# Altium schematic sheet MB1035.SchDoc
size A4; DocumentNumber: 1; Revision: C.1(PCB.SCH); SheetNumber: 1; SheetTotal: 4; PageSetup: Record=PageOptions|CenterHorizontal=True|CenterVertical=True|PrintScale=1.00|XCorrection=1.00|YCorrection=1.00|PrintKind=1|BorderSize=5000000|LeftOffset=0|BottomOffset=0|Orientation=2|PaperLength=1000|PaperWidth=1000|Scale=100|PaperSource=15|PrintQuality=1200|MediaType=1|DitherType=10|PaperKind=A4|PrintScaleMode=1
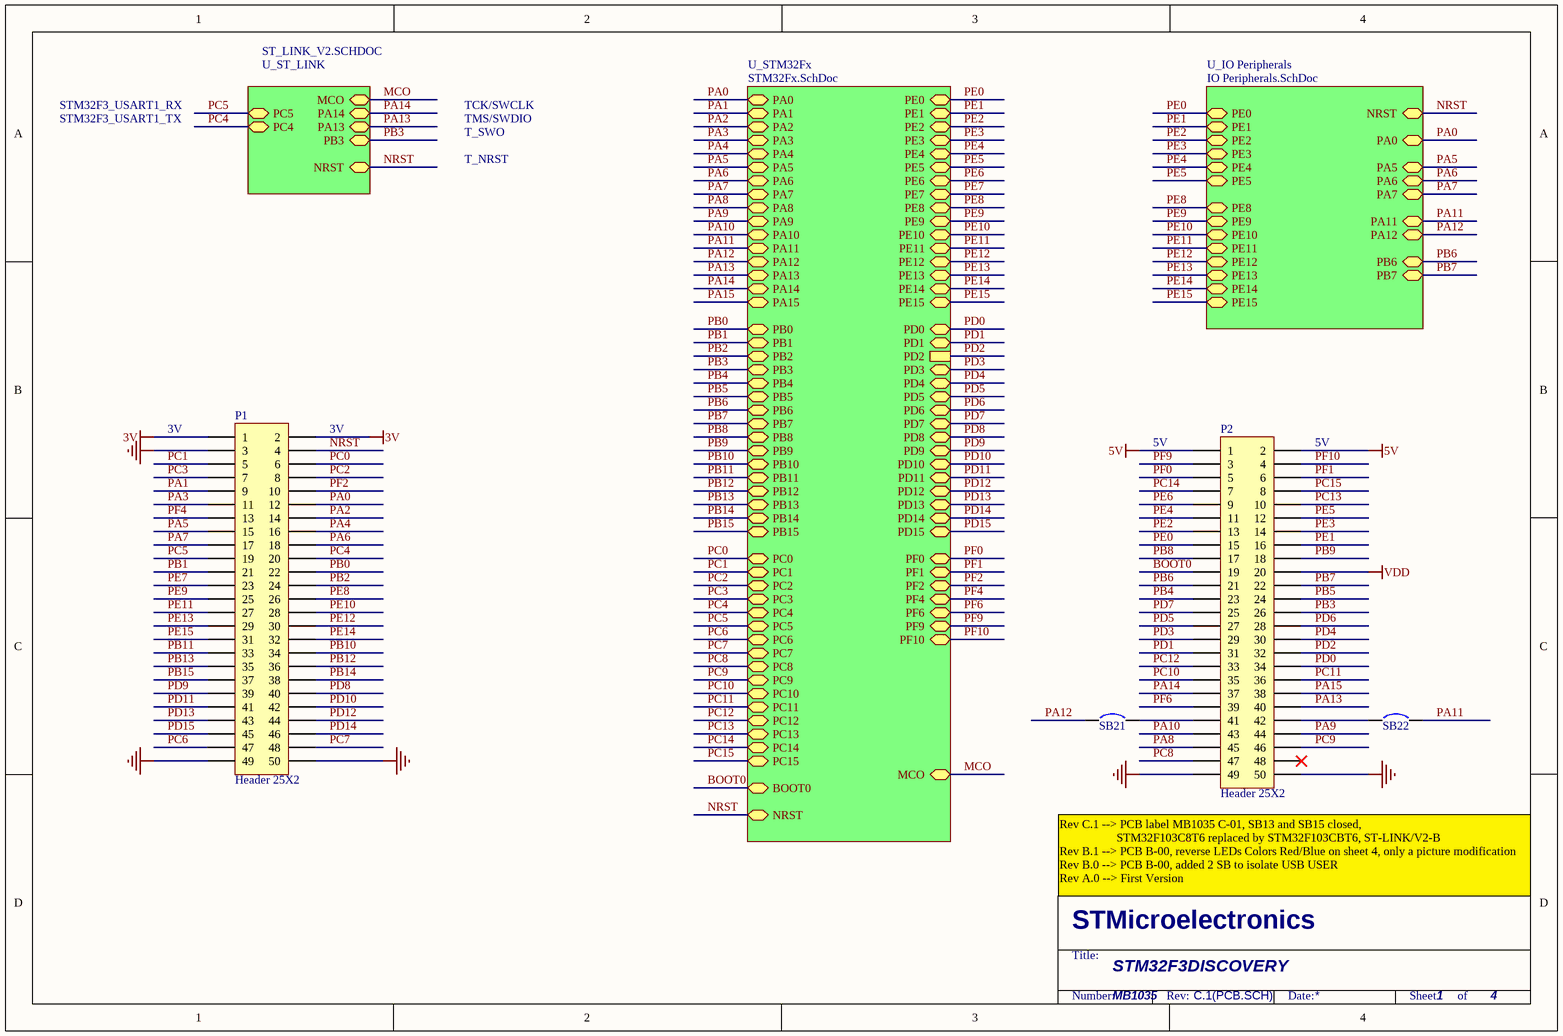
[diagram p0: MB1035.SchDoc]

## Parts
P1  Header 25X2  [HEAD25X2/2.54]
P2  Header 25X2  [HEAD25X2/2.54]
SB21  Circuit Breaker  [JP2_SMD]  (value not drawn)
SB22  Circuit Breaker  [JP2_SMD]  (value not drawn)

## Sub-sheets
U_IO Peripherals = IO Peripherals.SchDoc: PA0, NRST, PE0, PE1, PE3, PA5, PA7, PA6, PB6, PB7, PE4, PE5, PE2, PE8, PE15, PA11, PA12, PE9, PE10, PE11, PE12, PE13, PE14
U_ST_LINK = ST_LINK_V2.SCHDOC: PA13, PA14, NRST, PC5, PC4, PB3, MCO
U_STM32Fx = STM32Fx.SchDoc: PB8, PC5, PC4, PD2, BOOT0, NRST, PE0, PE1, PE2, PE3, PE4, PE5, PE6, PE7, PE8, PE9, PE10, PE11, PE12, PE13, PE14, PE15, PD0, PD1, PD3, PD4, PD5, PD6, PD7, PD8, PD9, PD10, PD11, PD12, PD13, PD14, PD15, PC15, PC14, PF1, PF0, MCO, PF2, PF4, PF6, PF9, PF10, PC0, PC1, PC2, PC3, PC6, PC7, PC8, PC9, PC10, PC11, PC12, PC13, PA0, PA1, PA2, PA3, PA4, PA5, PA6, PA7, PA8, PA9, PA10, PA11, PA12, PA13, PA14, PA15, PB0, PB1, PB2, PB3, PB4, PB5, PB6, PB7, PB9, PB10, PB11, PB12, PB13, PB14, PB15

## Nets
3V: P1.1 P1.2
5V: P2.1 P2.2
GND: P1.3 P1.49 P1.50 P2.49 P2.50
VDD: P2.20
BOOT0: P2.19 ; sheet U_STM32Fx/BOOT0
MCO: sheet U_ST_LINK/MCO, sheet U_STM32Fx/MCO
NRST: P1.4 ; sheet U_ST_LINK/NRST, sheet U_IO Peripherals/NRST, sheet U_STM32Fx/NRST
PA0: P1.12 ; sheet U_IO Peripherals/PA0, sheet U_STM32Fx/PA0
PA1: P1.9 ; sheet U_STM32Fx/PA1
PA2: P1.14 ; sheet U_STM32Fx/PA2
PA3: P1.11 ; sheet U_STM32Fx/PA3
PA4: P1.16 ; sheet U_STM32Fx/PA4
PA5: P1.15 ; sheet U_IO Peripherals/PA5, sheet U_STM32Fx/PA5
PA6: P1.18 ; sheet U_IO Peripherals/PA6, sheet U_STM32Fx/PA6
PA7: P1.17 ; sheet U_IO Peripherals/PA7, sheet U_STM32Fx/PA7
PA8: P2.45 ; sheet U_STM32Fx/PA8
PA9: P2.44 ; sheet U_STM32Fx/PA9
PA10: P2.43 ; sheet U_STM32Fx/PA10
PA11: SB22.2 ; sheet U_IO Peripherals/PA11, sheet U_STM32Fx/PA11
PA12: SB21.1 ; sheet U_IO Peripherals/PA12, sheet U_STM32Fx/PA12
PA13: P2.40 ; sheet U_ST_LINK/PA13, sheet U_STM32Fx/PA13
PA14: P2.37 ; sheet U_ST_LINK/PA14, sheet U_STM32Fx/PA14
PA15: P2.38 ; sheet U_STM32Fx/PA15
PB0: P1.22 ; sheet U_STM32Fx/PB0
PB1: P1.21 ; sheet U_STM32Fx/PB1
PB2: P1.24 ; sheet U_STM32Fx/PB2
PB3: P2.26 ; sheet U_ST_LINK/PB3, sheet U_STM32Fx/PB3
PB4: P2.23 ; sheet U_STM32Fx/PB4
PB5: P2.24 ; sheet U_STM32Fx/PB5
PB6: P2.21 ; sheet U_IO Peripherals/PB6, sheet U_STM32Fx/PB6
PB7: P2.22 ; sheet U_IO Peripherals/PB7, sheet U_STM32Fx/PB7
PB8: P2.17 ; sheet U_STM32Fx/PB8
PB9: P2.18 ; sheet U_STM32Fx/PB9
PB10: P1.34 ; sheet U_STM32Fx/PB10
PB11: P1.33 ; sheet U_STM32Fx/PB11
PB12: P1.36 ; sheet U_STM32Fx/PB12
PB13: P1.35 ; sheet U_STM32Fx/PB13
PB14: P1.38 ; sheet U_STM32Fx/PB14
PB15: P1.37 ; sheet U_STM32Fx/PB15
PC0: P1.6 ; sheet U_STM32Fx/PC0
PC1: P1.5 ; sheet U_STM32Fx/PC1
PC2: P1.8 ; sheet U_STM32Fx/PC2
PC3: P1.7 ; sheet U_STM32Fx/PC3
PC4: P1.20 ; sheet U_ST_LINK/PC4, sheet U_STM32Fx/PC4
PC5: P1.19 ; sheet U_ST_LINK/PC5, sheet U_STM32Fx/PC5
PC6: P1.47 ; sheet U_STM32Fx/PC6
PC7: P1.48 ; sheet U_STM32Fx/PC7
PC8: P2.47 ; sheet U_STM32Fx/PC8
PC9: P2.46 ; sheet U_STM32Fx/PC9
PC10: P2.35 ; sheet U_STM32Fx/PC10
PC11: P2.36 ; sheet U_STM32Fx/PC11
PC12: P2.33 ; sheet U_STM32Fx/PC12
PC13: P2.10 ; sheet U_STM32Fx/PC13
PC14: P2.7 ; sheet U_STM32Fx/PC14
PC15: P2.8 ; sheet U_STM32Fx/PC15
PD0: P2.34 ; sheet U_STM32Fx/PD0
PD1: P2.31 ; sheet U_STM32Fx/PD1
PD2: P2.32 ; sheet U_STM32Fx/PD2
PD3: P2.29 ; sheet U_STM32Fx/PD3
PD4: P2.30 ; sheet U_STM32Fx/PD4
PD5: P2.27 ; sheet U_STM32Fx/PD5
PD6: P2.28 ; sheet U_STM32Fx/PD6
PD7: P2.25 ; sheet U_STM32Fx/PD7
PD8: P1.40 ; sheet U_STM32Fx/PD8
PD9: P1.39 ; sheet U_STM32Fx/PD9
PD10: P1.42 ; sheet U_STM32Fx/PD10
PD11: P1.41 ; sheet U_STM32Fx/PD11
PD12: P1.44 ; sheet U_STM32Fx/PD12
PD13: P1.43 ; sheet U_STM32Fx/PD13
PD14: P1.46 ; sheet U_STM32Fx/PD14
PD15: P1.45 ; sheet U_STM32Fx/PD15
PE0: P2.15 ; sheet U_IO Peripherals/PE0, sheet U_STM32Fx/PE0
PE1: P2.16 ; sheet U_IO Peripherals/PE1, sheet U_STM32Fx/PE1
PE2: P2.13 ; sheet U_IO Peripherals/PE2, sheet U_STM32Fx/PE2
PE3: P2.14 ; sheet U_IO Peripherals/PE3, sheet U_STM32Fx/PE3
PE4: P2.11 ; sheet U_IO Peripherals/PE4, sheet U_STM32Fx/PE4
PE5: P2.12 ; sheet U_IO Peripherals/PE5, sheet U_STM32Fx/PE5
PE6: P2.9 ; sheet U_STM32Fx/PE6
PE7: P1.23 ; sheet U_STM32Fx/PE7
PE8: P1.26 ; sheet U_IO Peripherals/PE8, sheet U_STM32Fx/PE8
PE9: P1.25 ; sheet U_IO Peripherals/PE9, sheet U_STM32Fx/PE9
PE10: P1.28 ; sheet U_IO Peripherals/PE10, sheet U_STM32Fx/PE10
PE11: P1.27 ; sheet U_IO Peripherals/PE11, sheet U_STM32Fx/PE11
PE12: P1.30 ; sheet U_IO Peripherals/PE12, sheet U_STM32Fx/PE12
PE13: P1.29 ; sheet U_IO Peripherals/PE13, sheet U_STM32Fx/PE13
PE14: P1.32 ; sheet U_IO Peripherals/PE14, sheet U_STM32Fx/PE14
PE15: P1.31 ; sheet U_IO Peripherals/PE15, sheet U_STM32Fx/PE15
PF0: P2.5 ; sheet U_STM32Fx/PF0
PF1: P2.6 ; sheet U_STM32Fx/PF1
PF2: P1.10 ; sheet U_STM32Fx/PF2
PF4: P1.13 ; sheet U_STM32Fx/PF4
PF6: P2.39 ; sheet U_STM32Fx/PF6
PF9: P2.3 ; sheet U_STM32Fx/PF9
PF10: P2.4 ; sheet U_STM32Fx/PF10
NetP2_41: P2.41 SB21.2
NetP2_42: P2.42 SB22.1

Not connected (* = marked no-connect by the designer): P2 48*

## Notes on the sheet
- STM32F3_USART1_RX
- TCK/SWCLK
- STM32F3_USART1_TX
- TMS/SWDIO
- T_SWO
- T_NRST
- 3V
- (near P1) 3V
- 5V
- (near P2) 5V
- (near P2) Rev C.1 --> PCB label MB1035 C-01, SB13 and SB15 closed,
  STM32F103C8T6 replaced by STM32F103CBT6, ST-LINK/V2-B
  Rev B.1 --> PCB B-00, reverse LEDs Colors Red/Blue on sheet 4, only a picture modification
  Rev B.0 --> PCB B-00, added 2 SB to isolate USB USER
  Rev A.0 --> First Version
- STM32F3DISCOVERY
- MB1035
- 1
- STMicroelectronics
- Title:
- Number:
- Rev:
- Date:
- Sheet       of

## Library data of the parts
P1 P2 = Header 25X2: Header, 25-Pin, Dual row; LatestRevisionDate: 17-Jul-2002; LatestRevisionNote: Re-released for DXP Platform.; Publisher: Altium Limited
SB21 SB22 = Circuit Breaker: Solder: NO; Published: 24-Mar-1999; Revision: July-2002: Re-released for DXP Platform.; Publisher: Altium Limited